# Altium project Rangefinder.PrjPcb
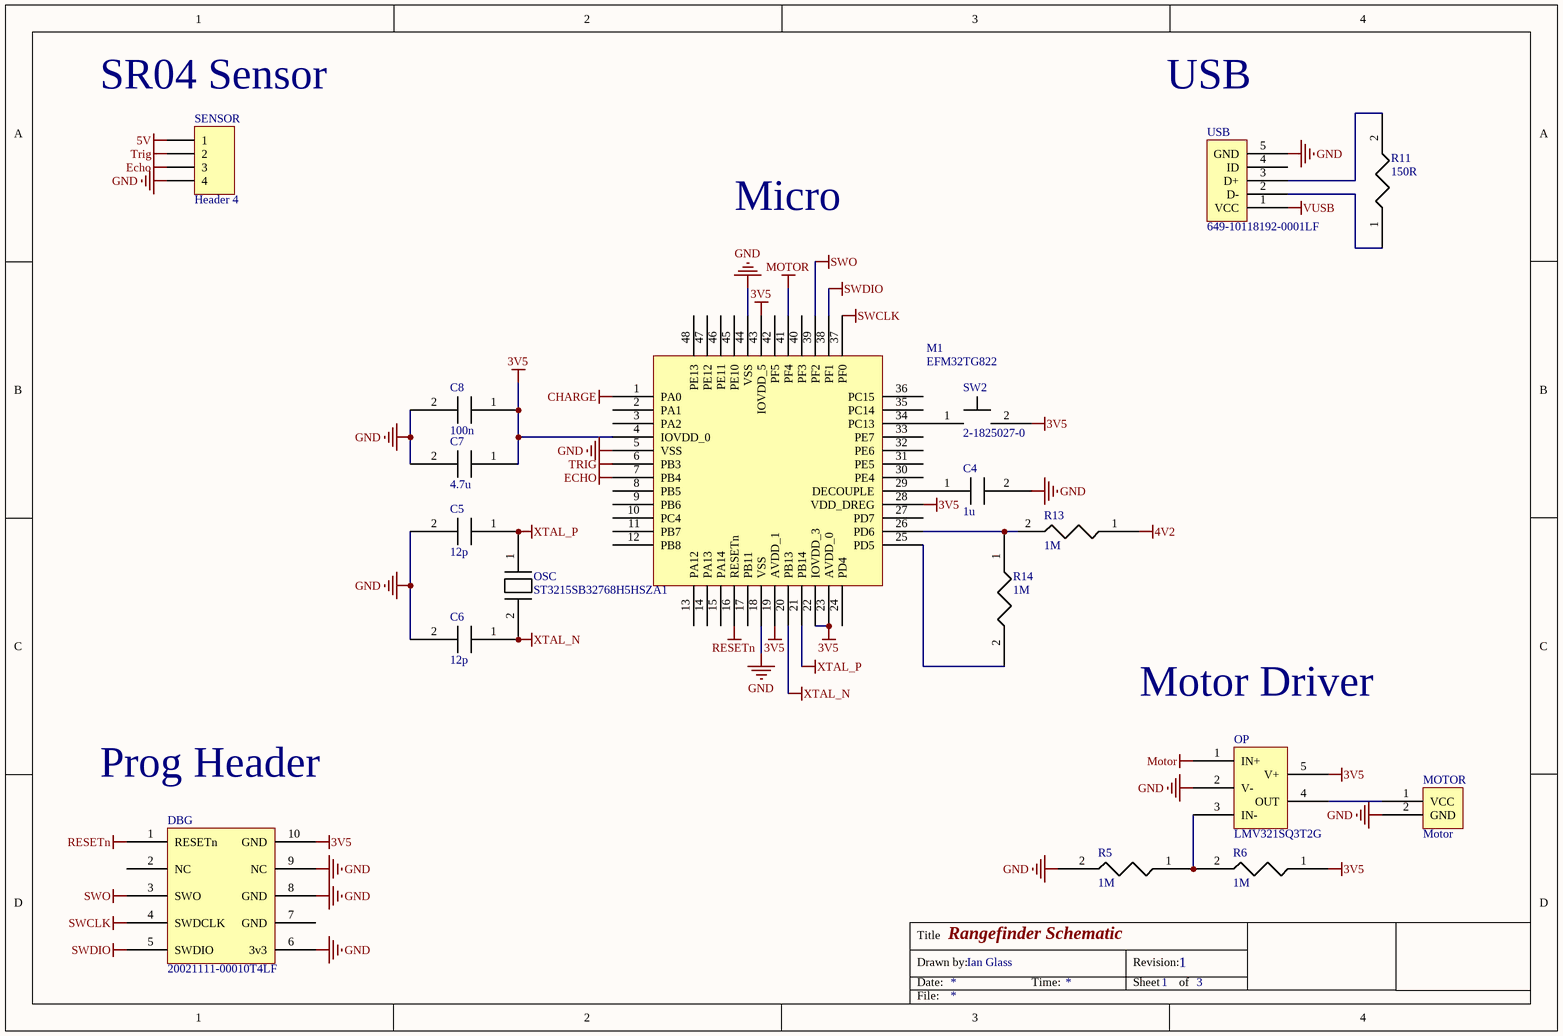
[diagram p0: Rangefinder.SchDoc]
2 sheets, 24 parts. Net scope: global (net labels, ports and power ports of the same name join across sheets).
Board file: Rangefinder_PCB.PcbDoc
Sheets:
  Rangefinder.SchDoc
  Boost_Converter.SchDoc

## Sheet Rangefinder.SchDoc: Rangefinder Schematic
size A4; DrawnBy: Ian Glass; Engineer: Ian Glass; Revision: 1; SheetNumber: 1; SheetTotal: 3

### Parts
C4  1u  [Capacitor 0402]
C5  12p  [Capacitor 0402]
C6  12p  [Capacitor 0402]
C7  4.7u  [Capacitor 0805]
C8  100n  [Capacitor 0402]
DBG  20021111-00010T4LF  [20021111-00010T4LF]
M1  EFM32TG822  [EFM32TG822]
MOTOR  Motor  [Motor]
OP  LMV321SQ3T2G  [LMV321SQ3T2G]
OSC  ST3215SB32768H5HSZA1  [ST3215SB32768H5HSZA1]
R5  1M  [Resistor 0403]
R6  1M  [Resistor 0403]
R11  150R  [Resistor 0603]
R13  1M  [Resistor 0403]
R14  1M  [Resistor 0403]
SENSOR  Header 4  [HDR1X4]
SW2  2-1825027-0  [2-1825027-0]
USB  649-10118192-0001LF  [649-10118192-0001LF]

### Nets
3V5: C7.1 C8.1 DBG.10(GND) M1.4(IOVDD_0) M1.19(AVDD_1) M1.22(IOVDD_3) M1.23(AVDD_0) M1.28(VDD_DREG) M1.43(IOVDD_5) OP.5(V+) R6.1 SW2.2
4V2: R13.1
5V: SENSOR.1
CHARGE: M1.1(PA0)
Echo: M1.7(PB4) SENSOR.3
GND: C4.2 C5.2 C6.2 C7.2 C8.2 DBG.6(3v3) DBG.8(GND) DBG.9(NC) M1.5(VSS) M1.18(VSS) M1.44(VSS) MOTOR.2(GND) OP.2(V-) R5.2 SENSOR.4 USB.5(GND)
MOTOR: M1.41(PF4) OP.1(IN+)
RESETn: DBG.1(RESETn) M1.16(RESETn)
SWCLK: DBG.4(SWDCLK) M1.37(PF0)
SWDIO: DBG.5(SWDIO) M1.38(PF1)
SWO: DBG.3(SWO) M1.39(PF2)
Trig: M1.6(PB3) SENSOR.2
VUSB: USB.1(VCC)
XTAL_N: C6.1 M1.20(PB13) OSC.2
XTAL_P: C5.1 M1.21(PB14) OSC.1
NetC4_1: C4.1 M1.29(DECOUPLE)
NetM1_25: M1.25(PD5) R14.2
NetM1_26: M1.26(PD6) R13.2 R14.1
NetM1_34: M1.34(PC13) SW2.1
NetMOTOR_1: MOTOR.1(VCC) OP.4(OUT)
NetOP_3: OP.3(IN-) R5.1 R6.2
NetR11_1: R11.1 USB.2(D-)
NetR11_2: R11.2 USB.3(D+)

Not connected (* = marked no-connect by the designer): DBG 2(NC) 7(GND); M1 2(PA1) 3(PA2) 8(PB5) 9(PB6) 10(PC4) 11(PB7) 12(PB8) 13(PA12) 14(PA13) 15(PA14) 17(PB11) 24(PD4) 27(PD7) 30(PE4) 31(PE5) 32(PE6) 33(PE7) 35(PC14) 36(PC15) 40(PF3) 42(PF5) 45(PE10) 46(PE11) 47(PE12) 48(PE13); USB 4(ID)

### Notes on the sheet
- (near SENSOR) SR04 Sensor
- USB
- Micro
- Motor Driver
- Prog Header
- Title
- Drawn by:
- Date:
- Time:
- Revision:
- Sheet
- of
- File:

### Library data of the parts
C4-C6 C8 = Capacitor 0402
C7 = Capacitor 0805
R5 R6 R13 R14 = Resistor 0403
R11 = Resistor 0603
SENSOR = Header 4: Header, 4-Pin; LatestRevisionDate: 17-Jul-2002; LatestRevisionNote: Re-released for DXP Platform.; Publisher: Altium Limited

## Sheet Boost_Converter.SchDoc: Boost Converter Schematic
size A4; DrawnBy: Ian Glass; Revision: 1; SheetNumber: 2; SheetTotal: 3
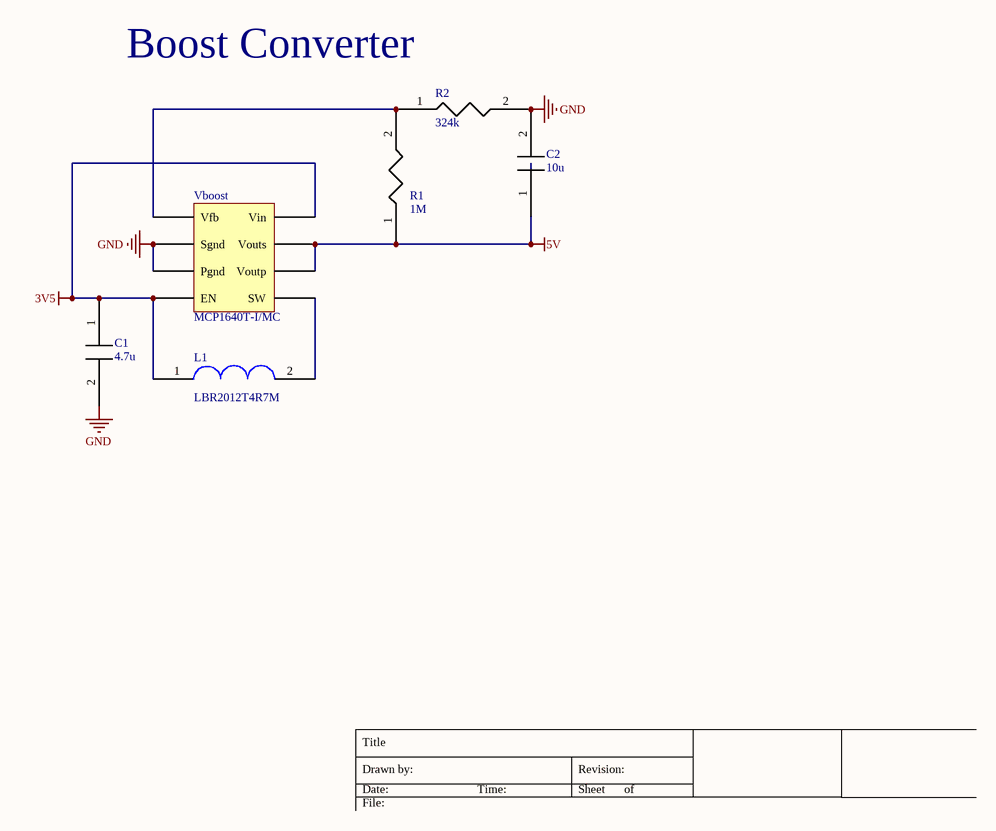
[diagram p1: Boost_Converter.SchDoc]

### Parts
C1  4.7u  [Capacitor 0805]
C2  10u  [Capacitor 0805]
L1  LBR2012T4R7M  [LBR2012T4R7M]
R1  1M  [Resistor 0403]
R2  324k  [Resistor 0603]
Vboost  MCP1640T-I/MC  [MCP1640T-I/MC]

### Nets
3V5: C1.1 L1.1 Vboost.4(EN) Vboost.8(Vin)
5V: C2.1 R1.1 Vboost.6(Voutp) Vboost.7(Vouts)
GND: C1.2 C2.2 R2.2 Vboost.2(Sgnd) Vboost.3(Pgnd)
NetL1_2: L1.2 Vboost.5(SW)
NetR1_2: R1.2 R2.1 Vboost.1(Vfb)

### Notes on the sheet
- (near R2) Boost Converter
- Title
- Drawn by:
- Date:
- Time:
- Revision:
- Sheet
- of
- File:

### Library data of the parts
C1 C2 = Capacitor 0805
R1 = Resistor 0403
R2 = Resistor 0603

## Nets that join several sheets
3V5: Rangefinder (12 pins), Boost_Converter (C1.1 L1.1 Vboost.4 Vboost.8)
5V: Rangefinder (SENSOR.1), Boost_Converter (C2.1 R1.1 Vboost.6 Vboost.7)
GND: Rangefinder (16 pins), Boost_Converter (5 pins)